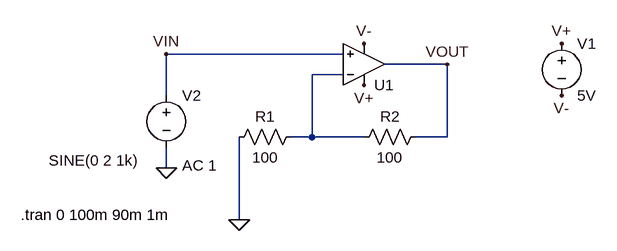
[diagram p0: schematic Amplifying.asc]
Amplifying.asc, the LTspice schematic file:
Version 4.1
SHEET 1 880 680
WIRE 192 160 -80 160
WIRE 352 176 256 176
WIRE 192 192 144 192
WIRE -80 224 -80 160
WIRE 144 288 144 192
WIRE 144 288 112 288
WIRE 224 288 144 288
WIRE 352 288 352 176
WIRE 352 288 304 288
WIRE -80 336 -80 304
WIRE 32 416 32 288
FLAG 528 224 V-
FLAG 224 144 V-
FLAG 224 208 V+
FLAG 528 144 V+
FLAG -80 336 0
FLAG 32 416 0
FLAG -80 160 VIN
FLAG 352 176 VOUT
SYMBOL OpAmps\\UniversalOpAmp 224 176 M180
SYMATTR InstName U1
SYMBOL voltage 528 128 R0
SYMATTR InstName V1
SYMATTR Value 5V
SYMBOL voltage -80 208 R0
WINDOW 3 -181 116 Left 2
WINDOW 123 24 124 Left 2
WINDOW 39 0 0 Left 0
SYMATTR InstName V2
SYMATTR Value SINE(0 2 1k)
SYMATTR Value2 AC 1
SYMBOL res 128 272 R90
WINDOW 0 0 56 VBottom 2
WINDOW 3 32 56 VTop 2
SYMATTR InstName R1
SYMATTR Value 100
SYMBOL res 320 272 R90
WINDOW 0 0 56 VBottom 2
WINDOW 3 32 56 VTop 2
SYMATTR InstName R2
SYMATTR Value 100
TEXT -304 408 Left 2 !.tran 0 100m 90m 1m

The netlist it stands for:
* Amplifying.asc
X§U1 VIN N001 V+ V- VOUT level1 Avol=1Meg GBW=10Meg Vos=0 En=0 Enk=0 In=0 Ink=0 Rin=500Meg  ; pins In+ In- V+ V- OUT
V1 V+ V- 5V
V2 VIN 0 SINE(0 2 1k) AC 1
R1 N001 0 100
R2 VOUT N001 100
.tran 0 100m 90m 1m
.lib UniversalOpAmp1.lib
.backanno
.end